# EAGLE design Dash4 (EAGLE 9.3.2)
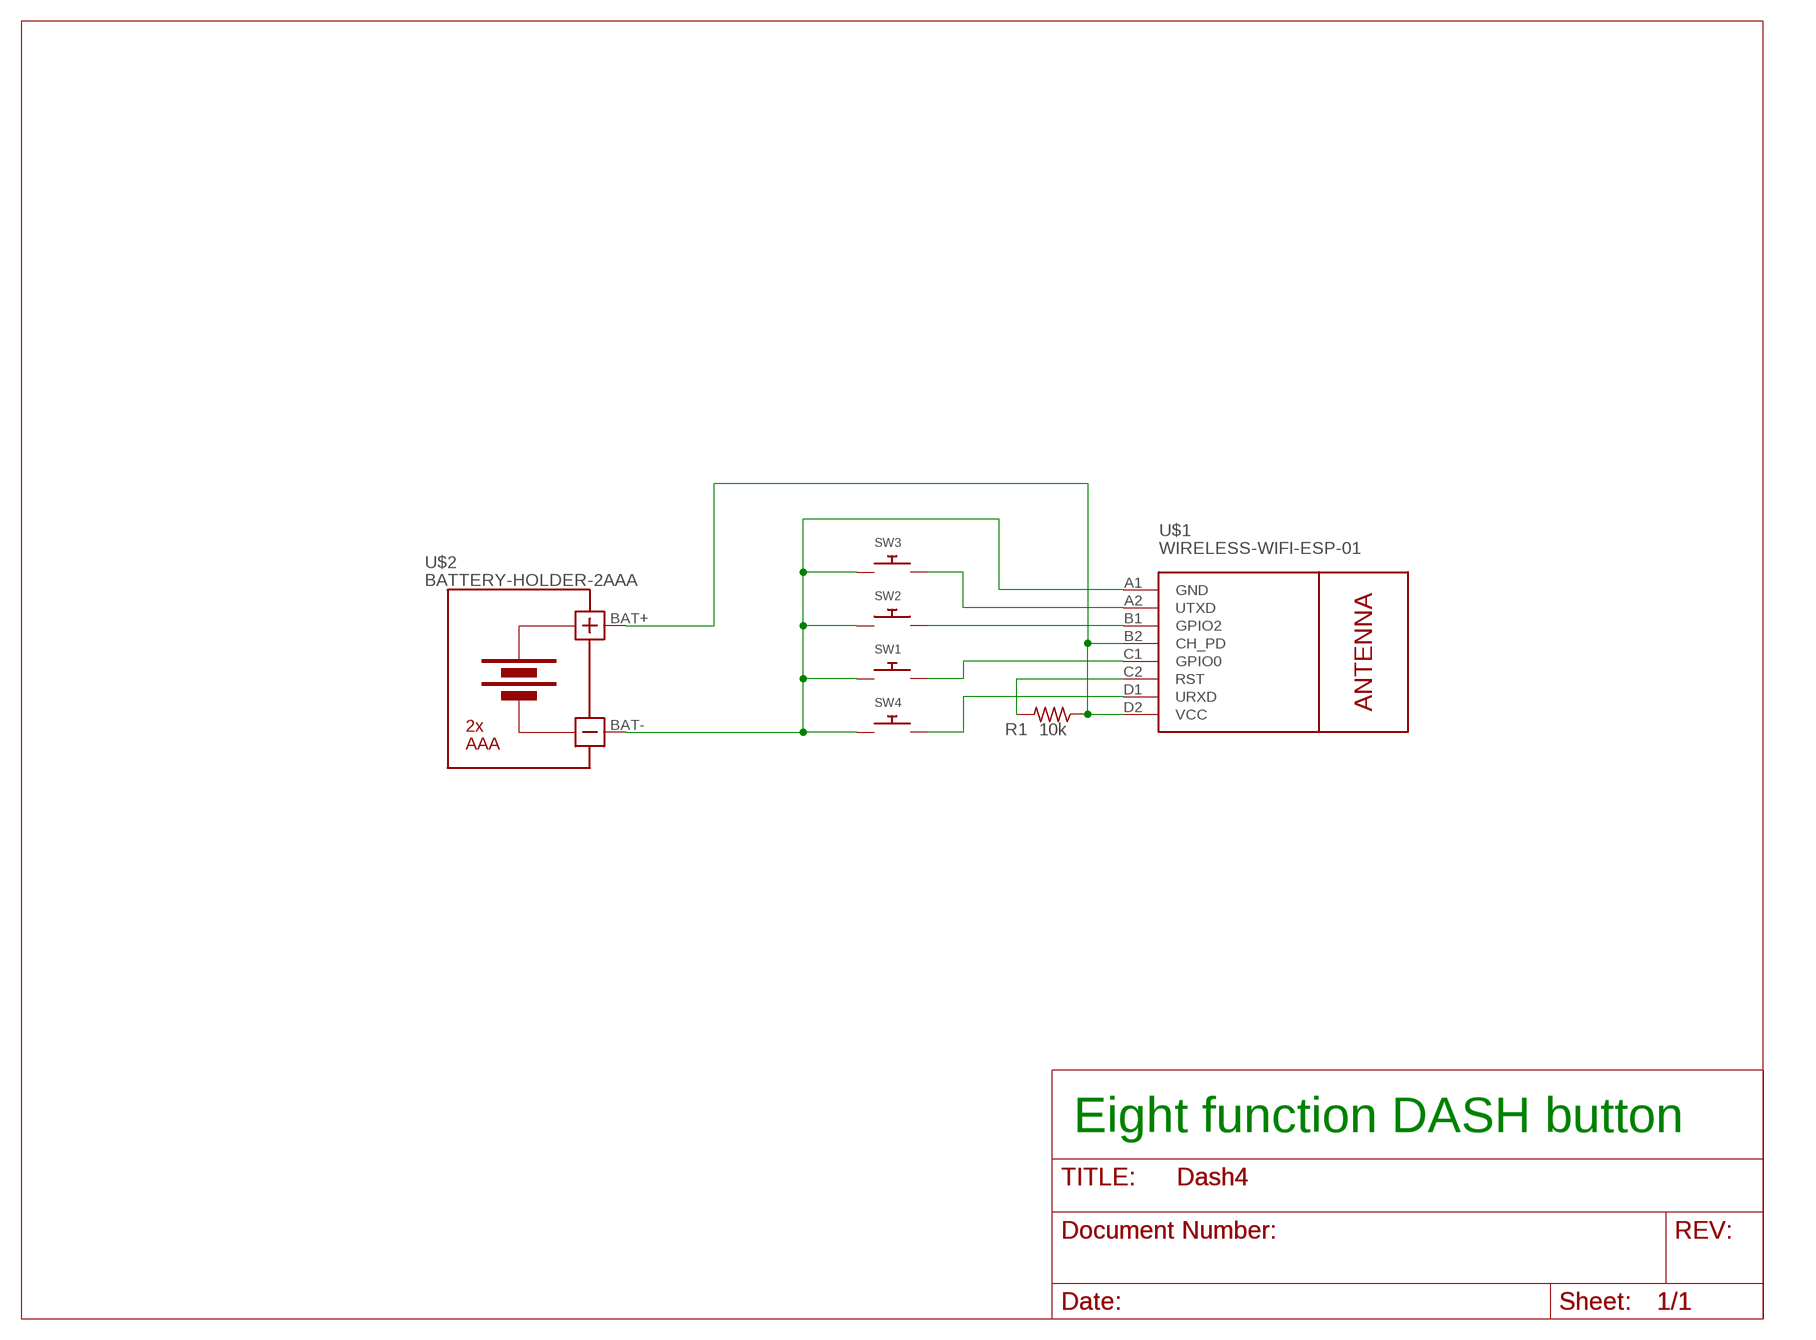
[diagram p0: schematic, sheet 1]

## Parts
R1  10k  R-US_0207/9  [0207/9]
SW1  SWITCH_PUSHBUTTONEVQ-PE  [TACT_PANA-EVQ]
SW2  SWITCH_PUSHBUTTONEVQ-PE  [TACT_PANA-EVQ]
SW3  SWITCH_PUSHBUTTONEVQ-PE  [TACT_PANA-EVQ]
SW4  SWITCH_PUSHBUTTONEVQ-PE  [TACT_PANA-EVQ]
U$1  WIRELESS-WIFI-ESP-01  [WIRELESS-WIFI-ESP-01]
U$2  BATTERY-HOLDER-2AAA  [BATTERY-HOLDER-2AAA]

## Nets
N$1: SW4.P$2 U$1.D1(URXD)
N$2: R1.1 U$1.B2(CH_PD) U$1.D2(VCC) U$2.BAT+
N$3: R1.2 U$1.C2(RST)
N$4: SW1.P$2 U$1.C1(GPIO0)
N$5: SW2.P$2 U$1.B1(GPIO2)
N$6: SW3.P$2 U$1.A2(UTXD)
N$7: SW1.P$1 SW2.P$1 SW3.P$1 SW4.P$1 U$1.A1(GND) U$2.BAT-

## Notes on the sheet
- Eight function DASH button

## Library data of the parts
R1 = adafruit:R-US_: RESISTOR, American symbol
SW1-SW4 = adafruit:SWITCH_PUSHBUTTON: Buttons SOFTTOUCHSMD_SJ - Soft touch temporary push button (Super Junk Akihabara) Compatible with SKPMANE010 [Mouser: 688-SKPMAN] C&K_KSS = Digikey: KSS221GLFS
U$1 = diy-modules:WIRELESS-WIFI-ESP-01: Wireless Wi-Fi ESP-01 Module based on ESP8266 chip Click here to find device on ebay.com <http://www.ebay.com/sch/esp8266+esp+01+transceiver>
U$2 = diy-modules:BATTERY-HOLDER-2AAA: Battery Holder 2 x AAA Click here to find device on ebay.com <http://www.ebay.com/sch/battery+plastic+holder+aaa+2x1.5v>

## Board
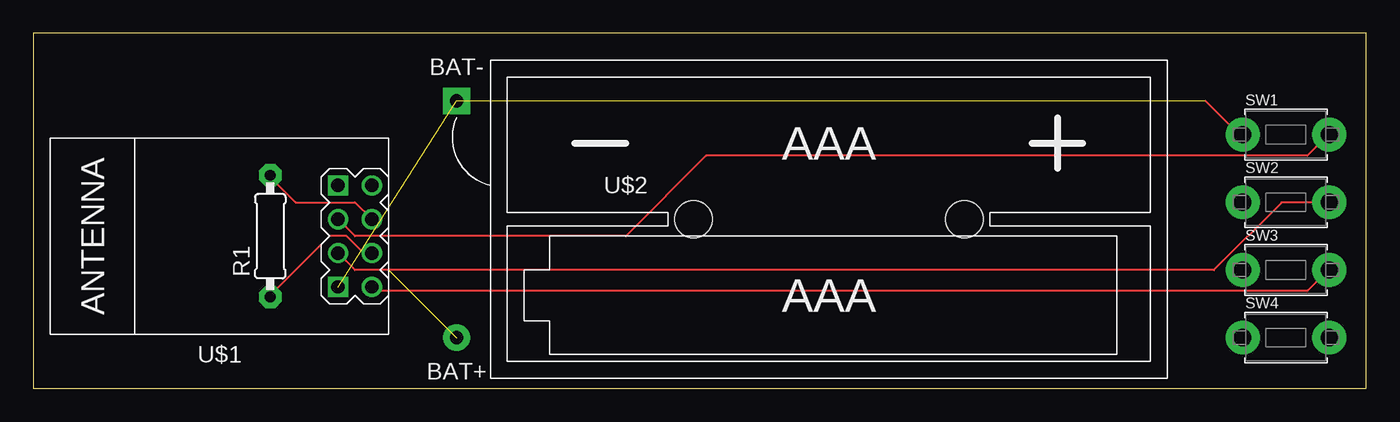
[diagram p1: board, top side]
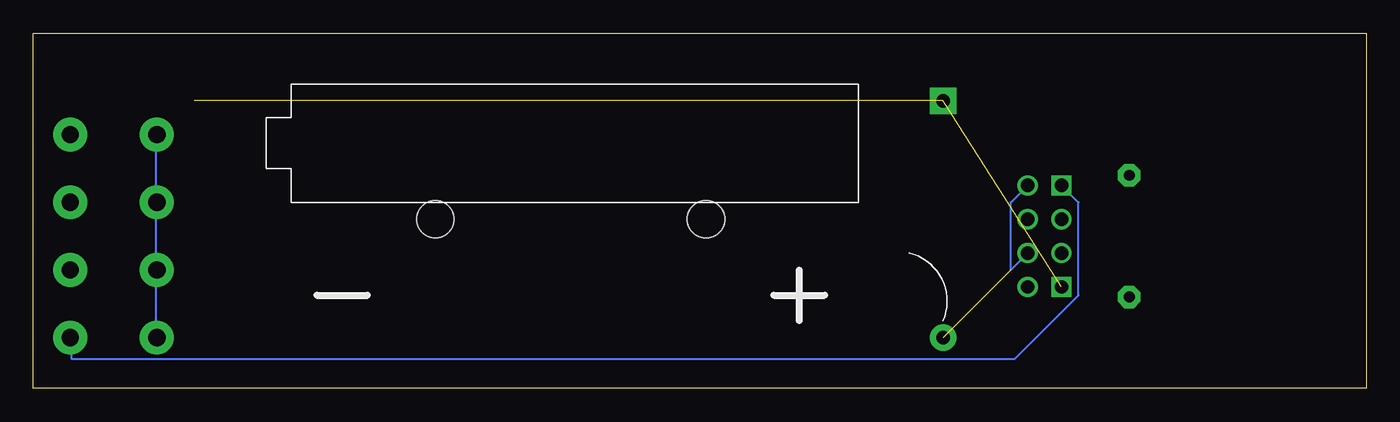
[diagram p2: board, bottom side, seen from below]

Size 100 x 26.66 mm. Coordinates in mm from the lower left corner, seen from the top.
Outline: 0,0 100,0 100,26.66 0,26.66 0,0
Copper layers (1*16): Top 0.035mm / dielectric 1.5mm / Bottom 0.035mm
Design rules "default": minimum track width 6mil, minimum drill 0.35mm, track to track 6mil, track to pad 6mil, pad to pad 6mil, via to via 6mil, smd to smd 6mil, copper to edge 40mil, drill to drill 6mil, minimum pad ring 10mil, minimum via ring 8mil, stop-mask expansion 4mil, vias tented up to drill 0mil, thermal gap 10mil

### Footprints (pad centres in the part's own frame; a part is rotated, then mirrored left to right if it is on the bottom)
0207/9 = drill 0.813 pad 1.676 octagon: 1 -4.572,0; 2 4.572,0
TACT_PANA-EVQ = drill 1.3 pad 2.54: P$1 -3.25,0; P$2 3.25,0
WIRELESS-WIFI-ESP-01 = drill 1 square: A1 -8.89,3.81; D1 -8.89,-3.81 | drill 1: A2 -11.43,3.81; B1 -8.89,1.27; B2 -11.43,1.27; C1 -8.89,-1.27; C2 -11.43,-1.27; D2 -11.43,-3.81
BATTERY-HOLDER-2AAA = drill 1 pad 2: BAT+ -27.94,-8.89 | drill 1 pad 2 square: BAT- -27.94,8.89 | hole 2.8: -10.16,0; 10.16,0

### Placement (x,y rotation side)
R1  17.78,11.43 90 top
SW1  93.98,19.05 0 top
SW2  93.98,13.97 0 top
SW3  93.98,8.89 0 top
SW4  93.98,3.81 0 top
U$1  13.97,11.43 180 top
U$2  59.69,12.7 0 top

### Tracks (layer width: path | path; a pad name or v marks a point on that pad's centre or on a via)
N$1
  Bottom 0.152: U$1.D1 21.59,13.97 21.59,6.99 26.35,2.22 97.16,2.22 97.16,3.81 SW4.P$2
N$2  (1 unrouted)
  Top 0.152: U$1.B2 24.77,10.16 23.5,11.43 22.23,11.43 17.78,6.99 R1.1
  Bottom 0.152: U$1.B2 26.67,8.89 26.67,13.97 U$1.D2
N$3
  Top 0.152: U$1.C2 24.13,13.97 19.68,13.97 17.78,15.88 R1.2
N$4
  Top 0.152: U$1.C1 24.13,11.43 44.45,11.43 50.48,17.46 95.57,17.46 97.16,19.05 SW1.P$2
N$5
  Top 0.152: U$1.B1 24.13,8.89 88.58,8.89 93.66,13.97 SW2.P$2
N$6
  Top 0.152: U$1.A2 25.72,7.3 95.57,7.3 97.16,8.89 SW3.P$2
N$7  (2 unrouted)
  Top 0.152: 87.95,21.59 90.49,19.05 SW1.P$1
  Bottom 0.152: 90.81,8.89 90.81,3.81 SW4.P$1 | 90.81,13.97 90.81,19.05 SW1.P$1 | 90.81,13.97 90.81,8.89 | 90.81,8.89 SW3.P$1 | 90.81,13.97 SW2.P$1